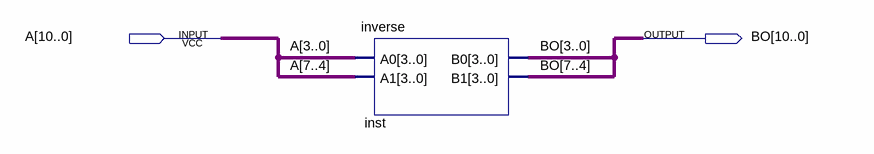
[diagram p0: schematic sheet]
// Quartus schematic operating_automat.bdf as structural Verilog: 1 symbols, 2 pins
module operating_automat (
  input  [10:0] A,
  output [10:0] BO
);

  inverse inst (.A0(A[3:0]), .A1(A[7:4]), .B0(BO[3:0]), .B1(BO[7:4]));
endmodule
